# Altium schematic sheet MCU.SchDoc
size A
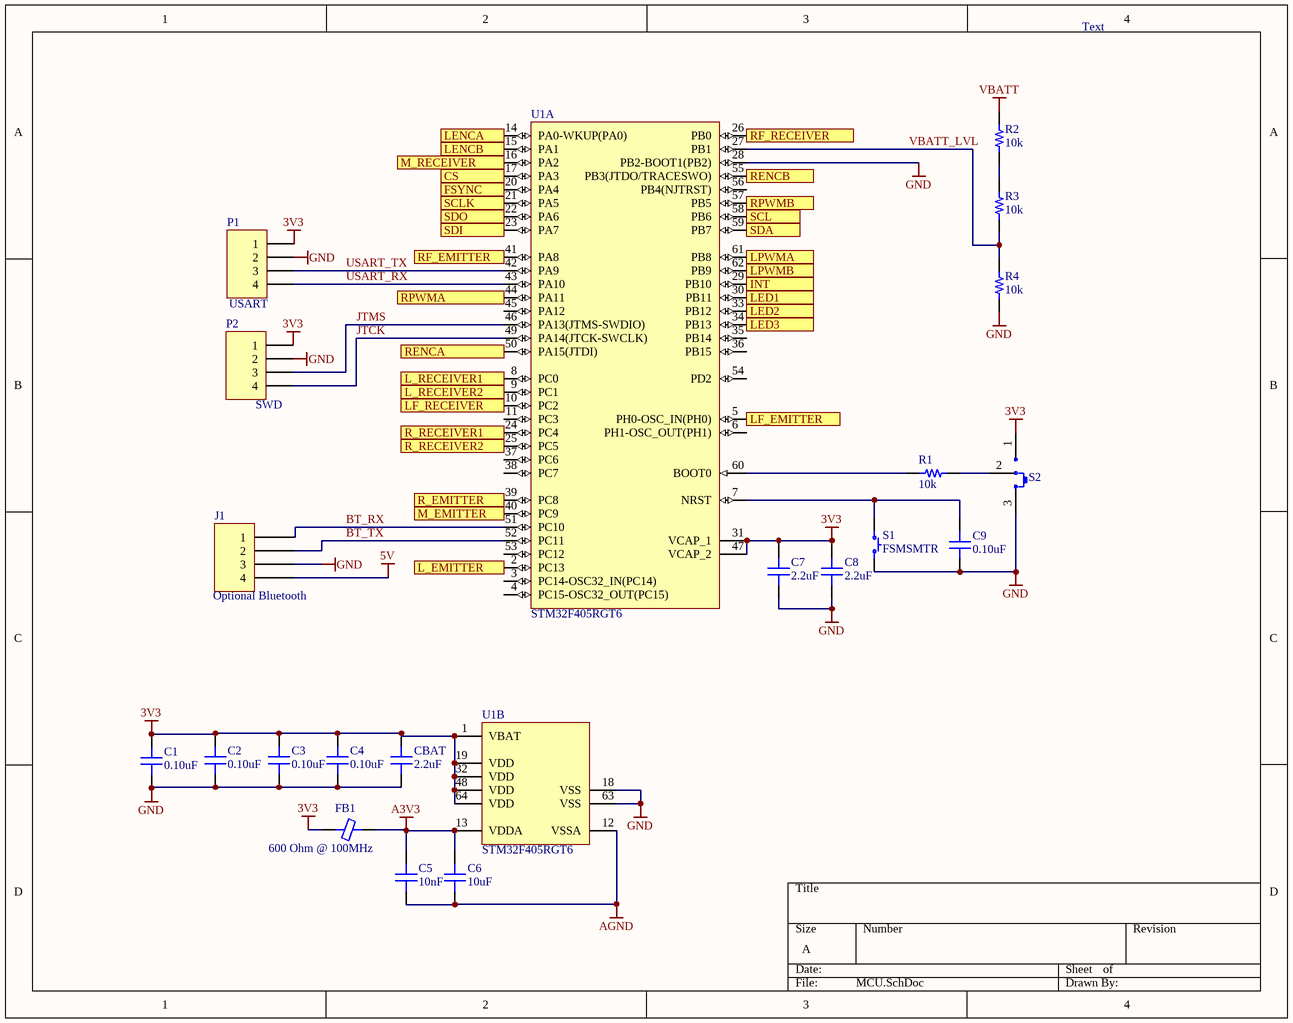
[diagram p0: MCU.SchDoc]

## Parts
C1  0.10uF  [CAP 0402/1005]
C2  0.10uF  [CAP 0402/1005]
C3  0.10uF  [CAP 0402/1005]
C4  0.10uF  [CAP 0402/1005]
C5  10nF  [CAP 0402/1005]
C6  10uF  [CAP 0603/1608]
C7  2.2uF  [CAP 0402/1005]
C8  2.2uF  [CAP 0402/1005]
C9  0.10uF  [CAP 0402/1005]
CBAT  2.2uF  [CAP 0402/1005]
FB1  600 Ohm @ 100MHz  [FER 0603/1608]
J1  NPPN041BFCN-RC  [SULLINS NPPN041BFCN]  (value not drawn)
P1  Header 4  [HDR1X4]  (value not drawn)
P2  (no value)  [HDR1X4]
R1  10k  [RES 0402/1005]
R2  10k  [RES 0402/1005]
R3  10k  [RES 0402/1005]
R4  10k  [RES 0402/1005]
S1  FSMSMTR  [TE FSMSMTR]
S2  SS312SAH4-R  [NKK SS312SAH4]  (value not drawn)
U1  STM32F405RGT6  [STM-LQFP64_N]  (parts A,B of 2)

## Ports
CS (out), FSYNC (out), INT (in), L_EMITTER (out), L_RECEIVER1 (in), L_RECEIVER2 (in), LED1 (out), LED2 (out), LED3 (out), LENCA (in), LENCB (in), LF_EMITTER (out), LF_RECEIVER (in), LPWMA (out), LPWMB (out), M_EMITTER (out), M_RECEIVER (in), R_EMITTER (out), R_RECEIVER1 (in), R_RECEIVER2 (in), RENCA (in), RENCB (in), RF_EMITTER (out), RF_RECEIVER (in), RPWMA (out), RPWMB (out), SCL (out), SCLK (out), SDA (in), SDI (out), SDO (in)

## Nets
3V3: C1.2 C2.2 C3.2 C4.2 C7.2 C8.2 CBAT.2 FB1.2 P1.1 P2.1 S2.1 U1.1(VBAT) U1.19(VDD) U1.31(VCAP_1) U1.32(VDD) U1.47(VCAP_2) U1.48(VDD) U1.64(VDD)
5V: J1.4
A3V3: C5.2 C6.2 FB1.1 U1.13(VDDA)
AGND: C5.1 C6.1 U1.12(VSSA)
GND: C1.1 C2.1 C3.1 C4.1 C7.1 C8.1 C9.1 CBAT.1 J1.3 P1.2 P2.2 R4.1 S1.2 S2.3 U1.18(VSS) U1.28(PB2-BOOT1(PB2)) U1.63(VSS)
VBATT: R2.2
BT_RX: J1.1 U1.51(PC10)
BT_TX: J1.2 U1.52(PC11)
CS: U1.17(PA3) ; port CS
FSYNC: U1.20(PA4) ; port FSYNC
INT: U1.29(PB10) ; port INT
JTCK: P2.4 U1.49(PA14(JTCK-SWCLK))
JTMS: P2.3 U1.46(PA13(JTMS-SWDIO))
L_EMITTER: U1.2(PC13) ; port L_EMITTER
L_RECEIVER1: U1.8(PC0) ; port L_RECEIVER1
L_RECEIVER2: U1.9(PC1) ; port L_RECEIVER2
LED1: U1.30(PB11) ; port LED1
LED2: U1.33(PB12) ; port LED2
LED3: U1.34(PB13) ; port LED3
LENCA: U1.14(PA0-WKUP(PA0)) ; port LENCA
LENCB: U1.15(PA1) ; port LENCB
LF_EMITTER: U1.5(PH0-OSC_IN(PH0)) ; port LF_EMITTER
LF_RECEIVER: U1.10(PC2) ; port LF_RECEIVER
LPWMA: U1.61(PB8) ; port LPWMA
LPWMB: U1.62(PB9) ; port LPWMB
M_EMITTER: U1.40(PC9) ; port M_EMITTER
M_RECEIVER: U1.16(PA2) ; port M_RECEIVER
R_EMITTER: U1.39(PC8) ; port R_EMITTER
R_RECEIVER1: U1.24(PC4) ; port R_RECEIVER1
R_RECEIVER2: U1.25(PC5) ; port R_RECEIVER2
RENCA: U1.50(PA15(JTDI)) ; port RENCA
RENCB: U1.55(PB3(JTDO/TRACESWO)) ; port RENCB
RF_EMITTER: U1.41(PA8) ; port RF_EMITTER
RF_RECEIVER: U1.26(PB0) ; port RF_RECEIVER
RPWMA: U1.44(PA11) ; port RPWMA
RPWMB: U1.57(PB5) ; port RPWMB
SCL: U1.58(PB6) ; port SCL
SCLK: U1.21(PA5) ; port SCLK
SDA: U1.59(PB7) ; port SDA
SDI: U1.23(PA7) ; port SDI
SDO: U1.22(PA6) ; port SDO
USART_RX: P1.4 U1.43(PA10)
USART_TX: P1.3 U1.42(PA9)
VBATT_LVL: R3.1 R4.2 U1.27(PB1)
NetC9_2: C9.2 S1.1 U1.7(NRST)
NetR1_1: R1.1 U1.60(BOOT0)
NetR1_2: R1.2 S2.2(COM)
NetR2_1: R2.1 R3.2

Not connected (* = marked no-connect by the designer): U1 3(PC14-OSC32_IN(PC14)) 4(PC15-OSC32_OUT(PC15)) 6(PH1-OSC_OUT(PH1)) 11(PC3) 35(PB14) 36(PB15) 37(PC6) 38(PC7) 45(PA12) 53(PC12) 54(PD2) 56(PB4(NJTRST))

## Notes on the sheet
- Text
- (near P1) USART
- (near P2) SWD
- (near J1) Optional Bluetooth

## Library data of the parts
C1-C4 C9 = GCM155R71C104KA55D: CAP CER 0.1UF 16V X7R 0402; Manufacturer: Murata Electronics North America; TemperatureRange: -55C ~ 125C; Tolerance: 10%; Value: 0.10uF; Part Number: GCM155R71C104KA55D; PartId: 12362; Supplier 1: Digi-Key; Supplier Part Number 1: 490-4759-2-ND; ComponentLink1Description: Datasheet; ComponentLink1URL: http://www.murata.com/~/media/webrenewal/support/library/catalog/products/capacitor/mlcc/c03e.ashx; ComponentLink2Description: Digi-Key Listing; ComponentLink2URL: https://www.digikey.com/product-detail/en/murata-electronics-north-america/GCM155R71C104KA55D/490-4759-2-ND/1641633; TemperatureCoefficient: X7R; Voltage: 16V; Price: 0.0088; Device Package: 0402 (1005 Metric)
C5 = CL05B103KO5NNNC: CAP CER 10000PF 16V X7R 0402; Manufacturer: Samsung Electro-Mechanics America, Inc.; TemperatureRange: -55C ~ 125C; Tolerance: 10%; Value: 10nF; Part Number: CL05B103KO5NNNC; PartId: 12520; Supplier 1: Digi-Key; Supplier Part Number 1: 1276-1051-2-ND; ComponentLink1Description: Datasheet; ComponentLink1URL: http://www.samsungsem.com/kr/support/library/product-catalog/__icsFiles/afieldfile/2015/11/18/MLCC.pdf; ComponentLink2Description: Digi-Key Listing; ComponentLink2URL: https://www.digikey.com/product-detail/en/samsung-electro-mechanics-america-inc/CL05B103KO5NNNC/1276-1051-2-ND/3886709; TemperatureCoefficient: X7R; Voltage: 16V; Price: 0.0017; Device Package: 0402 (1005 Metric)
C6 = CL10A106MQ8NNNC: CAP CER 10UF 6.3V X5R 0603; Manufacturer: Samsung Electro-Mechanics America, Inc.; TemperatureRange: -55C ~ 85C; Tolerance: 20%; Value: 10uF; Part Number: CL10A106MQ8NNNC; PartId: 13031; Supplier 1: Digi-Key; Supplier Part Number 1: 1276-1119-2-ND; ComponentLink1Description: Datasheet; ComponentLink1URL: http://www.samsungsem.com/kr/support/product-search/mlcc/CL10A106MQ8NNNC.jsp; ComponentLink2Description: Digi-Key Listing; ComponentLink2URL: https://www.digikey.com/product-detail/en/samsung-electro-mechanics-america-inc/CL10A106MQ8NNNC/1276-1119-2-ND/3886777; TemperatureCoefficient: X5R; Voltage: 6.3V; Price: 0.0274; Device Package: 0603 (1608 Metric)
C7 C8 CBAT = CL05A225KP5NSNC: CAP CER 2.2UF 10V X5R 0402; Manufacturer: Samsung Electro-Mechanics America, Inc.; TemperatureRange: -55C ~ 85C; Tolerance: 10%; Value: 2.2uF; Part Number: CL05A225KP5NSNC; PartId: 12898; Supplier 1: Digi-Key; Supplier Part Number 1: 1276-1108-2-ND; ComponentLink1Description: Datasheet; ComponentLink1URL: http://www.samsungsem.com/kr/support/product-search/mlcc/CL05A225KP5NSNC.jsp; ComponentLink2Description: Digi-Key Listing; ComponentLink2URL: https://www.digikey.com/product-detail/en/samsung-electro-mechanics-america-inc/CL05A225KP5NSNC/1276-1108-2-ND/3886766; TemperatureCoefficient: X5R; Voltage: 10V; Price: 0.0612; Device Package: 0402 (1005 Metric)
FB1 = MMZ1608B301CTAH0: FERRITE CHIP 300 OHM 500MA 0603; Part Number: BK1608HS601-T; DC Resistance: 450mOhm Max; Current Rating: 350mA; Value: 600 Ohm @ 100MHz; ComponentLink1Description: Datasheet; ComponentLink1URL: https://product.tdk.com/info/en/catalog/datasheets/beads_commercial_signal_mmz1608_en.pdf; ComponentLink2Description: Digi-Key listing; ComponentLink2URL: http://digikey.com/product-detail/en/MMZ1608B301CTAH0/445-2165-2-ND/600532; Device Package: 0603 (1608 Metric)
J1 = NPPN041BFCN-RC: CONN RECEPT 2MM SINGLE STR 4POS; Manufacturer: Sullins Connector Solutions; Pitch: 0.079" (2.00mm); Number Of Positions: 4; Part Number: NPPN041BFCN-RC; Colour: Black; PartId: 10883; Supplier 1: Digi-Key; Supplier Part Number 1: S5751-04-ND; ComponentLink1Description: Datasheet; ComponentLink1URL: http://www.sullinscorp.com/drawings/75_1BFC_10483.pdf; ComponentLink2Description: Digi-Key Listing; ComponentLink2URL: http://www.digikey.com/product-detail/en/sullins-connector-solutions/NPPN041BFCN-RC/S5751-04-ND/804806; Price: 0.89; Type: Header; Contact Finish: Gold; Fastening Type: -; Number Of Rows: 1; Series: -
P1 P2 = Header 4: Header, 4-Pin; LatestRevisionDate: 17-Jul-2002; LatestRevisionNote: Re-released for DXP Platform.; Publisher: Altium Limited
R1 = RC0402JR-0710KL: RES SMD 10K OHM 5% 1/16W 0402; Manufacturer: Yageo; TemperatureRange: -55C ~ 155C; TemperatureCoefficient: 100ppm/C; PowerRating: 0.063W, 1/16W; Value: 10k; Part Number: RC0402JR-0710KL; PartId: 14464; Supplier 1: Digi-Key; Supplier Part Number 1: 311-10KJRTR-ND; ComponentLink1Description: Datasheet; ComponentLink1URL: http://www.yageo.com/documents/recent/PYu-RC_Group_51_RoHS_L_04.pdf; ComponentLink2Description: Digi-Key Listing; ComponentLink2URL: https://www.digikey.com/product-detail/en/yageo/RC0402JR-0710KL/311-10KJRTR-ND/726418; Tolerance: 5%; Price: 0.0017; Device Package: 0402 (1005 Metric)
R2-R4 = ERJ-2RKF1002X: RES SMD 10K OHM 1% 1/10W 0402; Manufacturer: Panasonic Electronic Components; TemperatureRange: -55C ~ 155C; TemperatureCoefficient: 100ppm/C; PowerRating: 0.1W, 1/10W; Value: 10k; Part Number: ERJ-2RKF1002X; PartId: 1; Supplier 1: Digi-Key; Supplier Part Number 1: P10.0KLTR-ND; ComponentLink1Description: Datasheet; ComponentLink1URL: http://industrial.panasonic.com/www-cgi/jvcr13pz.cgi?E+PZ+3+AOA0002+ERJ2RKF1002X+7+WW; ComponentLink2Description: Digikey listing; ComponentLink2URL: http://digikey.com/product-detail/en/ERJ-2RKF1002X/P10.0KLTR-ND/192073; Tolerance: 1%; Price: 0.0043; Type: Thick Film; Device Package: 0402 (1005 Metric)
S1 = FSMSMTR: SWITCH TACTILE SPST-NO 0.05A 24V; Manufacturer: TE Connectivity Alcoswitch Switches; Switch Function: Off-Mom; Contact Rating @ Voltage: 0.05A @ 24VDC; Actuator Type: Standard; Actuator Orientation: Top Actuated; Illumination: Non-Illuminated; Operating Force: 180gf; Switch Travel: 0.25mm; Mechanical Life: 20,000 Cycles; Part Number: FSMSMTR; PartId: 8251; Supplier 1: Digi-Key; Supplier Part Number 1: 450-1758-2-ND; ComponentLink1Description: Datasheet; ComponentLink1URL: http://www.te.com/commerce/DocumentDelivery/DDEController?Action=srchrtrv&DocNm=1437566-3&DocType=Customer+Drawing&DocLang=English; ComponentLink2Description: Digi-Key Listing; ComponentLink2URL: http://www.digikey.com/product-detail/en/FSMSMTR/450-1758-2-ND/529671; Price: 0.175; Circuit: SPST-NO; Illumination Voltage: -; Illumination Type, Colour: -; Operating Temperature: -35C ~ 85C
S2 = SS312SAH4-R: SWITCH SLIDE SPDT 0.4VA 28V; Manufacturer: NKK Switches; Switch Function: On-On; Actuator Type: Standard; Switch Travel: 2.00mm; Mechanical Life: 10,000 Cycles; Part Number: SS312SAH4-R; PartId: 16471; Supplier 1: Digi-Key; Supplier Part Number 1: 360-2924-2-ND; ComponentLink1Description: Datasheet; ComponentLink1URL: http://2t70un3m1d9z1kztamkdrd38.wpengine.netdna-cdn.com/wp-content/uploads/2016/02/SS3surfaceMount.pdf; ComponentLink2Description: Digi-Key Listing; ComponentLink2URL: http://www.digikey.com/product-detail/en/nkk-switches/SS312SAH4-R/360-2924-2-ND/2810472; Price: 1.953; TYPE: Slide Switches; Series: SS3; Circuit: SPDT; Operating Force: -; Operating Temperature: -25C ~ 85C
U1 = STM32F405RGT6: ARM Cortex-M4 32-bit MCU+FPU, 210 DMIPS, 1024 kB Flash, 192 kB Internal RAM, 51 I/Os, 64-pin LQFP, -40 to 85 degC, Tray; Manufacturer: STMicroelectronics; D/A Converter: 2x12-bit; FLASH Size (Prog) (kB): 1024; I/Os (High Current): 51; Internal RAM Size (kB): 192; Operating Frequency(F) (Processor speed) (MHz): 168; Supply Voltage(Vcc) max (V): 3.6; Supply Voltage(Vcc) min (V): 1.8; DatasheetVersion: Rev. 4; PackageVersion: Rev. 4, 06/2013; PackageReference: LQFP64; PackageDescription: 64-Pin Low Profile Quad Flat Package, 10 x 10 mm Body, 0.5 mm Pitch; Supplier 1: Digi-Key; Supplier Part Number 1: 497-11767-ND; Supplier 2: Farnell; Supplier Part Number 2: 2064363; Supplier 3: Newark; Supplier Part Number 3: 73T2329; Supplier 4: Mouser; Supplier Part Number 4: 511-STM32F405RGT6; Core: ARM Cortex-M4; Packing: Tray; Mounting Technology: Surface Mount; PartNumber: STM32F405RGT6; ComponentLink1Description: Manufacturer URL; ComponentLink1URL: http://www.st.com/web/en/home.html; ComponentLink2Description: Datasheet; ComponentLink2URL: http://www.st.com/st-web-ui/static/active/en/resource/technical/document/datasheet/DM00037051.pdf; ComponentLink3Description: Package Specification; ComponentLink3URL: http://www.st.com/st-web-ui/static/active/en/resource/technical/document/datasheet/DM00037051.pdf; Part Number: STM32F405RGT6